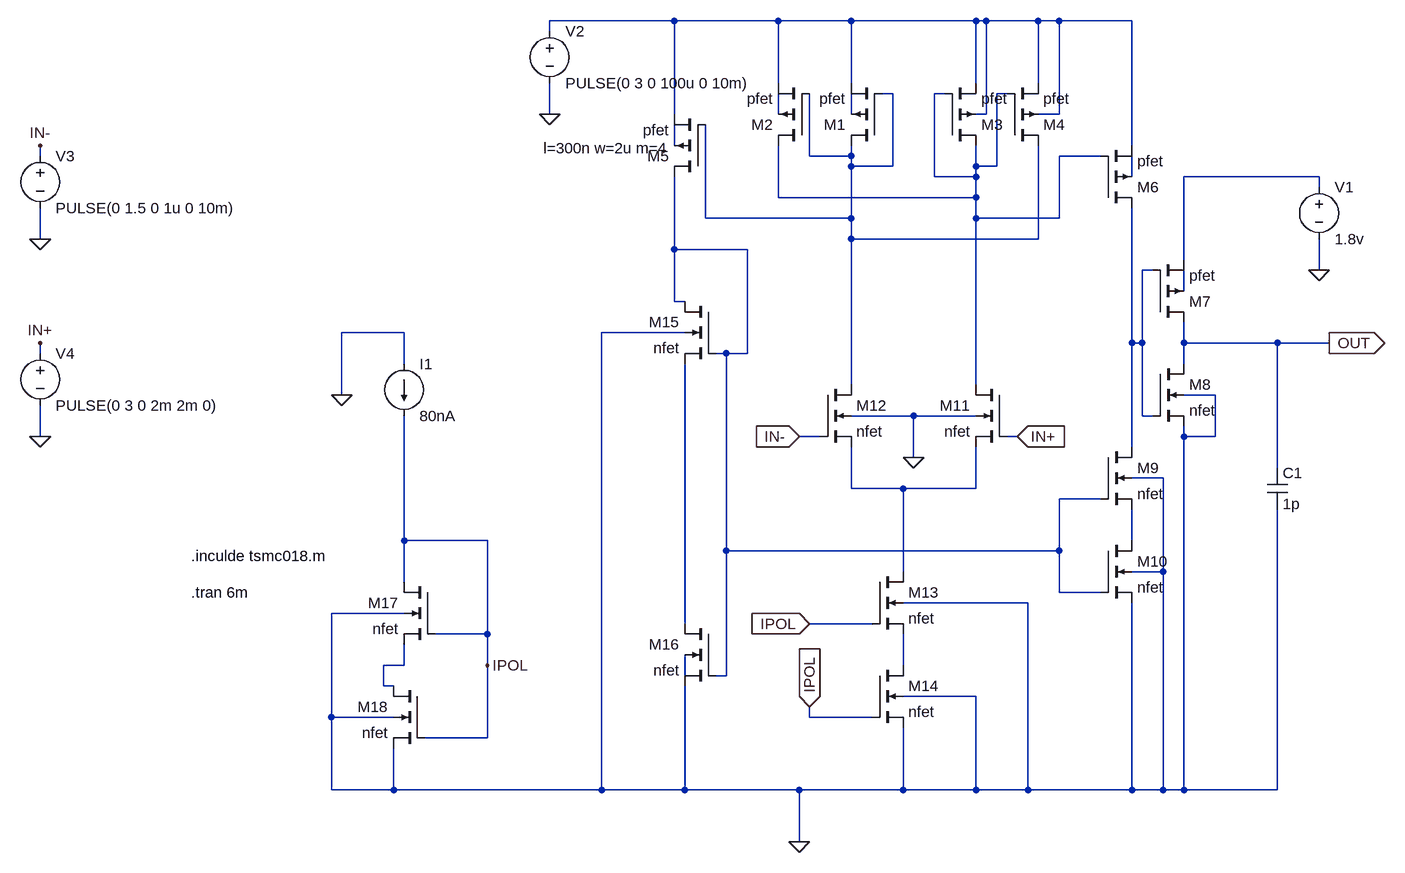
[diagram p0: schematic comparator2.asc]
comparator2.asc, the LTspice schematic file:
Version 4
SHEET 1 980 1272
WIRE -192 -32 -384 -32
WIRE -32 -32 -192 -32
WIRE 80 -32 -32 -32
WIRE 272 -32 80 -32
WIRE 288 -32 272 -32
WIRE 368 -32 288 -32
WIRE 400 -32 368 -32
WIRE 512 -32 400 -32
WIRE -384 -16 -384 -32
WIRE -32 64 -32 -32
WIRE 80 64 80 -32
WIRE 272 64 272 -32
WIRE 368 64 368 -32
WIRE 144 80 128 80
WIRE 224 80 208 80
WIRE 320 80 304 80
WIRE -384 112 -384 64
WIRE -192 112 -192 -32
WIRE -32 112 -32 80
WIRE 80 112 80 80
WIRE 288 112 288 -32
WIRE 288 112 272 112
WIRE 400 112 400 -32
WIRE 400 112 368 112
WIRE -192 160 -192 128
WIRE 512 160 512 -32
WIRE -1168 176 -1168 160
WIRE 16 176 16 80
WIRE 80 176 80 160
WIRE 80 176 16 176
WIRE 464 176 400 176
WIRE 80 192 80 176
WIRE 144 192 144 80
WIRE 144 192 80 192
WIRE 272 192 272 160
WIRE 304 192 304 80
WIRE 304 192 272 192
WIRE 208 208 208 80
WIRE 272 208 272 192
WIRE 272 208 208 208
WIRE 512 208 512 176
WIRE 800 208 592 208
WIRE 800 224 800 208
WIRE -32 240 -32 160
WIRE 272 240 272 208
WIRE 272 240 -32 240
WIRE -144 272 -144 128
WIRE 80 272 80 192
WIRE 80 272 -144 272
WIRE 272 272 272 240
WIRE 400 272 400 176
WIRE 400 272 272 272
WIRE -1168 304 -1168 256
WIRE 80 304 80 272
WIRE 368 304 368 160
WIRE 368 304 80 304
WIRE -192 320 -192 208
WIRE -80 320 -192 320
WIRE 592 336 592 208
WIRE 544 352 528 352
WIRE 800 352 800 304
WIRE 592 384 592 352
WIRE -192 400 -192 320
WIRE -176 400 -192 400
WIRE -608 448 -704 448
WIRE -176 448 -304 448
WIRE 512 464 512 256
WIRE 528 464 528 352
WIRE 528 464 512 464
WIRE 592 464 592 432
WIRE 736 464 592 464
WIRE 816 464 736 464
WIRE -1168 480 -1168 464
WIRE -112 480 -128 480
WIRE -80 480 -80 320
WIRE -80 480 -112 480
WIRE -608 496 -608 448
WIRE 592 496 592 464
WIRE 80 528 80 304
WIRE 272 528 272 272
WIRE -704 544 -704 448
WIRE 640 544 592 544
WIRE 176 576 80 576
WIRE 272 576 176 576
WIRE 528 576 528 464
WIRE 544 576 528 576
WIRE -1168 608 -1168 560
WIRE 32 608 0 608
WIRE 336 608 320 608
WIRE 592 608 592 592
WIRE 640 608 640 544
WIRE 640 608 592 608
WIRE 512 624 512 464
WIRE 176 640 176 576
WIRE 736 656 736 464
WIRE 560 672 512 672
WIRE 80 688 80 624
WIRE 160 688 80 688
WIRE 272 688 272 624
WIRE 272 688 160 688
WIRE 464 704 400 704
WIRE -608 768 -608 576
WIRE -480 768 -608 768
WIRE 512 768 512 720
WIRE -112 784 -112 480
WIRE 400 784 400 704
WIRE 400 784 -112 784
WIRE 160 816 160 688
WIRE 560 816 560 672
WIRE 560 816 512 816
WIRE -608 832 -608 768
WIRE 400 848 400 784
WIRE 464 848 400 848
WIRE 352 864 160 864
WIRE -608 880 -720 880
WIRE -176 896 -176 496
WIRE 112 896 16 896
WIRE -480 912 -480 768
WIRE -480 912 -560 912
WIRE -608 960 -608 928
WIRE -608 960 -640 960
WIRE -480 960 -480 912
WIRE 160 960 160 912
WIRE -176 976 -176 944
WIRE -112 976 -112 784
WIRE -112 976 -128 976
WIRE -640 992 -640 960
WIRE -624 992 -640 992
WIRE 272 1008 160 1008
WIRE -720 1040 -720 880
WIRE -624 1040 -720 1040
WIRE 16 1040 16 1024
WIRE 112 1040 16 1040
WIRE -480 1072 -480 960
WIRE -480 1072 -576 1072
WIRE -720 1152 -720 1040
WIRE -624 1152 -624 1088
WIRE -624 1152 -720 1152
WIRE -304 1152 -304 448
WIRE -304 1152 -624 1152
WIRE -176 1152 -176 992
WIRE -176 1152 -304 1152
WIRE 0 1152 -176 1152
WIRE 160 1152 160 1056
WIRE 160 1152 0 1152
WIRE 272 1152 272 1008
WIRE 272 1152 160 1152
WIRE 352 1152 352 864
WIRE 352 1152 272 1152
WIRE 512 1152 512 864
WIRE 512 1152 352 1152
WIRE 560 1152 560 816
WIRE 560 1152 512 1152
WIRE 592 1152 592 608
WIRE 592 1152 560 1152
WIRE 736 1152 736 720
WIRE 736 1152 592 1152
WIRE 0 1232 0 1152
FLAG 16 896 IPOL
IOPIN 16 896 In
FLAG 16 1024 IPOL
IOPIN 16 1024 In
FLAG 816 464 OUT
IOPIN 816 464 Out
FLAG 0 608 IN-
IOPIN 0 608 In
FLAG 0 1232 0
FLAG -704 544 0
FLAG 176 640 0
FLAG 336 608 IN+
IOPIN 336 608 In
FLAG 800 352 0
FLAG -384 112 0
FLAG -1168 304 0
FLAG -1168 608 0
FLAG -1168 160 IN-
FLAG -1168 464 IN+
FLAG -480 960 IPOL
SYMBOL pmos4 128 160 R180
SYMATTR InstName M1
SYMATTR Value pfet
SYMATTR Value2 l=2u w=2u m=1
SYMBOL pmos4 16 160 R180
SYMATTR InstName M2
SYMATTR Value pfet
SYMATTR Value2 l=2u w=2u m=5
SYMBOL pmos4 224 160 M180
SYMATTR InstName M3
SYMATTR Value pfet
SYMATTR Value2 l=2u w=2u m=1
SYMBOL pmos4 320 160 M180
SYMATTR InstName M4
SYMATTR Value pfet
SYMATTR Value2 l=2u w=2u m=5
SYMBOL pmos4 -144 208 R180
WINDOW 123 56 44 Left 2
SYMATTR Value2 l=300n w=2u m=4
SYMATTR InstName M5
SYMATTR Value pfet
SYMBOL pmos4 464 256 M180
SYMATTR InstName M6
SYMATTR Value pfet
SYMATTR Value2 l=300n w=2u m=4
SYMBOL pmos4 544 432 M180
SYMATTR InstName M7
SYMATTR Value pfet
SYMATTR Value2 l=300n w=2u m=2
SYMBOL nmos4 544 496 R0
SYMATTR InstName M8
SYMATTR Value nfet
SYMATTR Value2 l=350n w=2u m=2
SYMBOL nmos4 464 624 R0
SYMATTR InstName M9
SYMATTR Value nfet
SYMATTR Value2 l=20u w=220n
SYMBOL nmos4 464 768 R0
SYMATTR InstName M10
SYMATTR Value nfet
SYMATTR Value2 l=20u w=220n
SYMBOL nmos4 320 528 M0
SYMATTR InstName M11
SYMATTR Value nfet
SYMATTR Value2 l=350n w=1u
SYMBOL nmos4 32 528 R0
SYMATTR InstName M12
SYMATTR Value nfet
SYMATTR Value2 l=350n w=1u
SYMBOL nmos4 112 816 R0
SYMATTR InstName M13
SYMATTR Value nfet
SYMATTR Value2 l=350n w=2u
SYMBOL nmos4 112 960 R0
SYMATTR InstName M14
SYMATTR Value nfet
SYMATTR Value2 l=350n w=2u
SYMBOL nmos4 -128 400 M0
SYMATTR InstName M15
SYMATTR Value nfet
SYMATTR Value2 l=20u w=220n
SYMBOL nmos4 -128 896 M0
SYMATTR InstName M16
SYMATTR Value nfet
SYMATTR Value2 l=20u w=220n
SYMBOL nmos4 -560 832 M0
SYMATTR InstName M17
SYMATTR Value nfet
SYMATTR Value2 l=350n w=2u
SYMBOL nmos4 -576 992 M0
SYMATTR InstName M18
SYMATTR Value nfet
SYMATTR Value2 l=350n w=2u
SYMBOL current -608 496 R0
WINDOW 123 0 0 Left 0
WINDOW 39 0 0 Left 0
SYMATTR InstName I1
SYMATTR Value 80nA
SYMBOL cap 720 656 R0
SYMATTR InstName C1
SYMATTR Value 1p
SYMBOL voltage 800 208 R0
WINDOW 123 0 0 Left 0
WINDOW 39 0 0 Left 0
SYMATTR InstName V1
SYMATTR Value 1.8v
SYMBOL voltage -384 -32 R0
WINDOW 123 0 0 Left 0
WINDOW 39 0 0 Left 0
SYMATTR InstName V2
SYMATTR Value PULSE(0 3 0 100u 0 10m)
SYMBOL voltage -1168 160 R0
WINDOW 123 0 0 Left 0
WINDOW 39 0 0 Left 0
SYMATTR InstName V3
SYMATTR Value PULSE(0 1.5 0 1u 0 10m)
SYMBOL voltage -1168 464 R0
WINDOW 123 0 0 Left 0
WINDOW 39 0 0 Left 0
SYMATTR InstName V4
SYMATTR Value PULSE(0 3 0 2m 2m 0)
TEXT -936 848 Left 2 !.tran 6m
TEXT -936 792 Left 2 !.inculde tsmc018.m

The netlist it stands for:
* comparator2.asc
M1 N002 N002 N001 N005 pfet l=2u w=2u m=1
M2 N003 N002 N001 N004 pfet l=2u w=2u m=5
M3 N003 N003 N001 N001 pfet l=2u w=2u m=1
M4 N002 N003 N001 N001 pfet l=2u w=2u m=5
M5 N009 N002 N001 N006 pfet l=300n w=2u m=4
M6 N010 N003 N001 N007 pfet l=300n w=2u m=4
M7 OUT N010 N008 N011 pfet l=300n w=2u m=2
M8 OUT N010 0 0 nfet l=350n w=2u m=2
M9 N010 N009 N013 0 nfet l=20u w=220n
M10 N013 N009 0 0 nfet l=20u w=220n
M11 N003 IN+ N012 0 nfet l=350n w=1u
M12 N002 IN- N012 0 nfet l=350n w=1u
M13 N012 IPOL N016 0 nfet l=350n w=2u
M14 N016 IPOL 0 0 nfet l=350n w=2u
M15 N009 N009 N014 0 nfet l=20u w=220n
M16 N014 N009 0 N017 nfet l=20u w=220n
M17 IPOL IPOL N015 0 nfet l=350n w=2u
M18 N015 IPOL 0 0 nfet l=350n w=2u
I1 0 IPOL 80nA
C1 OUT 0 1p
V1 N008 0 1.8v
V2 N001 0 PULSE(0 3 0 100u 0 10m)
V3 IN- 0 PULSE(0 1.5 0 1u 0 10m)
V4 IN+ 0 PULSE(0 3 0 2m 2m 0)
.model NMOS NMOS
.model PMOS PMOS
.lib standard.mos
.tran 6m
.inculde tsmc018.m
.backanno
.end